# EAGLE design Capsense_Pad (EAGLE 7.5.0)
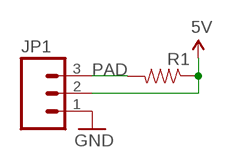
[diagram p0: schematic, sheet 1]

## Parts
JP1  M03PTH  [1X03]
R1  RESISTORAXIAL-0.3  [AXIAL-0.3]

## Nets
5V: JP1.2 R1.P$1
GND: JP1.1
PAD: JP1.3 R1.P$2

## Library data of the parts
JP1 = SparkFun-Connectors:M03: Header 3 Standard 3-pin 0.1" header. Use with straight break away headers (SKU : PRT-00116), right angle break away headers (PRT-00553), swiss pins (PRT-00743), machine pins (PRT-00117), and female headers (PRT-00115). Molex polarized connector foot print use with SKU : PRT-08232 with associated crimp pins and housings.
R1 = barbary_enterprises:RESISTOR: Resistor Basic schematic elements and footprints for 0603, 1206, and PTH resistors.

## Board
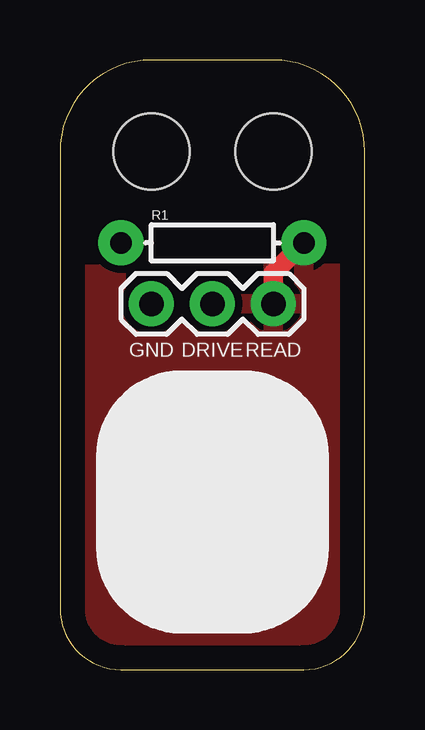
[diagram p1: board, top side]
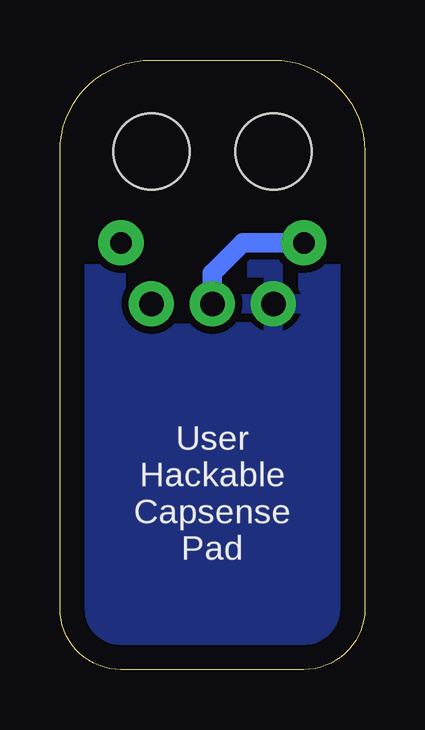
[diagram p2: board, bottom side, seen from below]

Size 12.7 x 25.4 mm. Coordinates in mm from the lower left corner, seen from the top.
Outline: 0,21.59 0,2.54 arc90 2.54,0 10.16,0 arc90 12.7,2.54 12.7,21.59 arc90 8.89,25.4 3.81,25.4 arc90 0,21.59
Copper layers (1*16): Top 0.035mm / dielectric 1.5mm / Bottom 0.035mm
Design rules "default": minimum track width 10mil, minimum drill 24mil, track to track 8mil, track to pad 8mil, pad to pad 8mil, via to via 8mil, smd to smd 8mil, copper to edge 40mil, drill to drill 8mil, minimum pad ring 10mil, minimum via ring 8mil, stop-mask expansion 4mil, vias tented up to drill 0mil, thermal gap 10mil
Holes 3.17 mm at 3.81,21.59 8.89,21.59

### Footprints (pad centres in the part's own frame; a part is rotated, then mirrored left to right if it is on the bottom)
1X03 = drill 1.016 pad 1.88: 1 0,0; 2 2.54,0; 3 5.08,0
AXIAL-0.3 = drill 0.9 pad 1.88: P$1 -3.81,0; P$2 3.81,0

### Placement (x,y rotation side)
JP1  3.81,15.24 0 top
R1  6.35,17.78 0 top

### Tracks (layer width: path | path; a pad name or v marks a point on that pad's centre or on a via)
5V
  Bottom 0.813: R1.P$1 5.08,17.78 6.35,16.51 JP1.2
GND
  pour Bottom (isolate 0.305): 0,0 12.7,0 12.7,17.78 0,17.78
PAD
  Top 0.813: JP1.3 8.89,16.51 R1.P$2
  pour Top (isolate 0.305): 0,0 12.7,0 12.7,16.51 0,16.51

### Text on the board
tPlace: GND | DRIVE | READ
bPlace: User / Hackable / Capsense / Pad